# Altium schematic sheet Sintetizador_BA.SchDoc
size A4
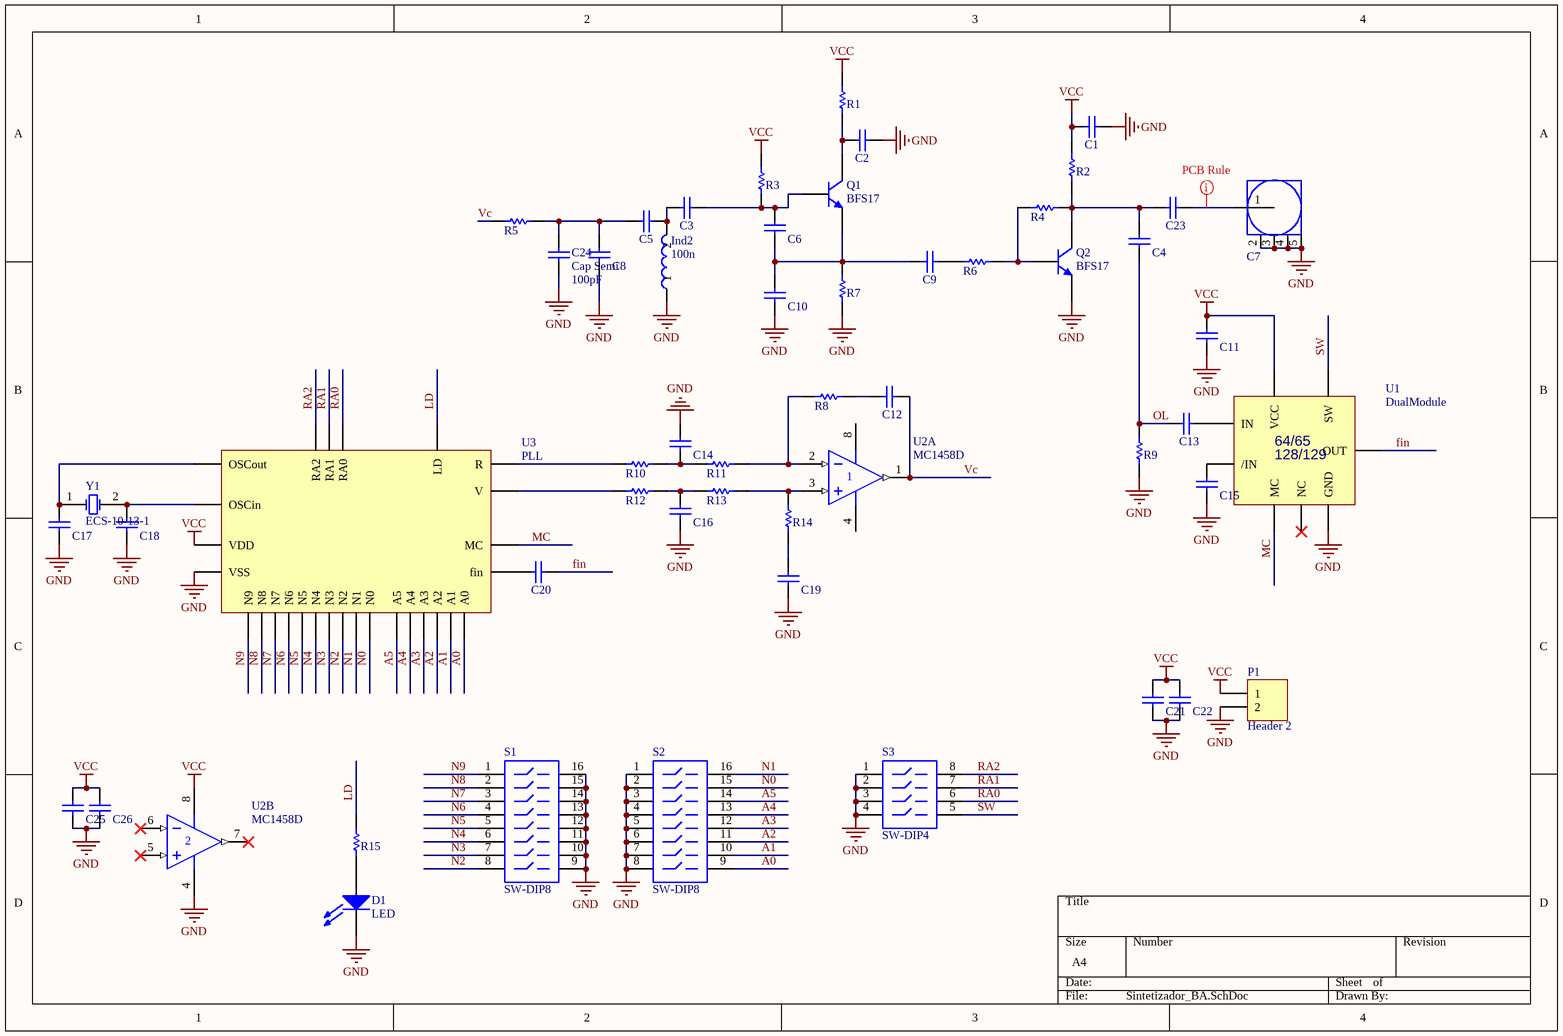
[diagram p0: Sintetizador_BA.SchDoc]

## Parts
C1  Capacitor  [0805_CAP]  (value not drawn)
C2  Capacitor  [0805_CAP]  (value not drawn)
C3  Capacitor  [0805_CAP]  (value not drawn)
C4  Capacitor  [0805_CAP]  (value not drawn)
C5  Capacitor  [0805_CAP]  (value not drawn)
C6  Capacitor  [0805_CAP]  (value not drawn)
C7  SMA  [SMAL2]  (value not drawn)
C8  Capacitor  [0805_CAP]  (value not drawn)
C9  Capacitor  [0805_CAP]  (value not drawn)
C10  Capacitor  [0805_CAP]  (value not drawn)
C11  Capacitor  [0805_CAP]  (value not drawn)
C12  Capacitor  [0805_CAP]  (value not drawn)
C13  Capacitor  [0805_CAP]  (value not drawn)
C14  Capacitor  [0805_CAP]  (value not drawn)
C15  Capacitor  [0805_CAP]  (value not drawn)
C16  Capacitor  [0805_CAP]  (value not drawn)
C17  Capacitor  [0805_CAP]  (value not drawn)
C18  Capacitor  [0805_CAP]  (value not drawn)
C19  Capacitor  [0805_CAP]  (value not drawn)
C20  Capacitor  [0805_CAP]  (value not drawn)
C21  Capacitor  [0805_CAP]  (value not drawn)
C22  Capacitor  [0805_CAP]  (value not drawn)
C23  Capacitor  [0805_CAP]  (value not drawn)
C24  Cap Semi  value 100pF  [C1206]
C25  Capacitor  [0805_CAP]  (value not drawn)
C26  Capacitor  [0805_CAP]  (value not drawn)
D1  LED  [PLCC-2Rojo]
Ind2  Valor: 100n  [Ind_4mm]  (hidden comment: Ind2)
P1  Header 2  [HDR1X2]
Q1  BFS17  [SOT-23]
Q2  BFS17  [SOT23_N]
R1  Resistor  [0805_RES]  (value not drawn)
R2  Resistor  [0805_RES]  (value not drawn)
R3  Resistor  [0805_RES]  (value not drawn)
R4  Resistor  [0805_RES]  (value not drawn)
R5  Resistor  [0805_RES]  (value not drawn)
R6  Resistor  [0805_RES]  (value not drawn)
R7  Resistor  [0805_RES]  (value not drawn)
R8  Resistor  [0805_RES]  (value not drawn)
R9  Resistor  [0805_RES]  (value not drawn)
R10  Resistor  [0805_RES]  (value not drawn)
R11  Resistor  [0805_RES]  (value not drawn)
R12  Resistor  [0805_RES]  (value not drawn)
R13  Resistor  [0805_RES]  (value not drawn)
R14  Resistor  [0805_RES]  (value not drawn)
R15  Resistor  [0805_RES]  (value not drawn)
S1  SW-DIP8  [DIP-16-KEY]
S2  SW-DIP8  [DIP-16-KEY]
S3  SW-DIP4  [DIP-8]
U1  DualModule  [SO-8_2]
U2  MC1458D  [751-05_N]  (parts A,B of 2)
U3  PLL  [SOG28]
Y1  ECS-10-13-1  [HC-49U]

## Nets
GND: C1.1 C2.1 C7.2(GND) C7.3(GND) C7.4(GND) C7.5(GND) C8.1 C10.2 C11.2 C14.2 C15.2 C16.1 C17.1 C18.1 C19.1 C21.1 C22.1 C24.2 C25.1 C26.1 D1.2(K) Ind2.1 P1.2 Q2.2(E) R7.1 R9.2 S1.9 S1.10 S1.11 S1.12 S1.13 S1.14 S1.15 S1.16 S2.1 S2.2 S2.3 S2.4 S2.5 S2.6 S2.7 S2.8 S3.1 S3.2 S3.3 S3.4 U1.5(GND) U2.4(V-) U3.2(VSS)
VCC: C1.2 C11.1 C21.2 C22.2 C25.2 C26.2 P1.1 R1.1 R2.1 R3.1 U1.2(VCC) U2.8(V+) U3.3(VDD)
A0: S2.9 U3.23(A0)
A1: S2.10 U3.21(A1)
A2: S2.11 U3.22(A2)
A3: S2.12 U3.24(A3)
A4: S2.13 U3.25(A4)
A5: S2.14 U3.10(A5)
fin: C20.1 U1.4(OUT)
LD: R15.1 U3.28(LD)
MC: U1.6(MC) U3.9(MC)
N0: S2.15 U3.11(N0)
N1: S2.16 U3.12(N1)
N2: S1.8 U3.13(N2)
N3: S1.7 U3.14(N3)
N4: S1.6 U3.15(N4)
N5: S1.5 U3.16(N5)
N6: S1.4 U3.17(N6)
N7: S1.3 U3.18(N7)
N8: S1.2 U3.19(N8)
N9: S1.1 U3.20(N9)
OL: C4.2 C13.2 R9.1
RA0: S3.6 U3.4(RA0)
RA1: S3.7 U3.5(RA1)
RA2: S3.8 U3.6(RA2)
SW: S3.5 U1.3(SW)
Vc: C12.1 R5.1 U2.1(OUT)
NetC2_2: C2.2 Q1.3(C) R1.2
NetC3_1: C3.1 C6.1 Q1.1(B) R3.2
NetC3_2: C3.2 C5.1 Ind2.2
NetC4_1: C4.1 C23.2 Q2.3(C) R2.2 R4.1
NetC5_2: C5.2 C8.2 C24.1 R5.2
NetC6_2: C6.2 C9.1 C10.1 Q1.2(E) R7.2
NetC7_1: C7.1(RF) C23.1
NetC9_2: C9.2 R6.2
NetC12_2: C12.2 R8.1
NetC13_1: C13.1 U1.1(IN)
NetC14_1: C14.1 R10.2 R11.1
NetC15_1: C15.1 U1.8(/IN)
NetC16_2: C16.2 R12.2 R13.1
NetC17_2: C17.2 U3.26(OSCout) Y1.1(OSC1)
NetC18_2: C18.2 U3.27(OSCin) Y1.2(OSC2)
NetC19_2: C19.2 R14.1
NetC20_2: C20.2 U3.1(fin)
NetD1_1: D1.1(A) R15.2
NetQ2_1: Q2.1(B) R4.2 R6.1
NetR8_2: R8.2 R11.2 U2.2(IN-)
NetR10_1: R10.1 U3.7(R)
NetR12_1: R12.1 U3.8(V)
NetR13_2: R13.2 R14.2 U2.3(IN+)

Not connected (* = marked no-connect by the designer): U1 7(NC)*; U2 5(IN+)* 6(IN-)* 7(OUT)*

## Layout directives
rule Width Constraint [Pref Width = 1mm    Min Width = 0.254mm    Max Width = 3mm]: NetC7_1

## Notes on the sheet
- (in symbol MC12054ASD) 64/65; 128/129

## Library data of the parts
C1-C6 C8-C23 C25 C26 = Cap
C24 = Cap Semi: Capacitor (Semiconductor SIM Model); Published: 8-Jun-2000; LatestRevisionDate: 17-Jul-2002; LatestRevisionNote: Re-released for DXP Platform.; PackageReference: C1206; Publisher: Altium Limited
D1 = LED1
P1 = Header 2: Header, 2-Pin; LatestRevisionDate: 17-Jul-2002; LatestRevisionNote: Re-released for DXP Platform.; Publisher: Altium Limited
Q1 Q2 = BFS17: NPN 1 GHz Wideband Transistor; Published: 17-Sep-2003; LatestRevisionDate: 12-Dec-2006; LatestRevisionNote: IPC-7351 Footprint Added.; DatasheetVersion: Sep-1995; PackageVersion: May-1999; PackageReference: SOT23; Publisher: Altium Limited; PackageDescription: 3-Pin SOT-23 Package 0.95 mm Pitch, 2.3 mm Lead Span; ComponentLink1Description: Manufacturer Link; ComponentLink1URL: http://www.semiconductors.philips.com/; ComponentLink2Description: Datasheet; ComponentLink2URL: http://www.semiconductors.philips.com/acrobat/datasheets/BFS17_2.pdf
R1-R15 = Res
S1 S2 = SW-DIP8: 4009 Series DIP Switch, Raised actuator; Published: 24-Mar-1999; LatestRevisionDate: 17-Dec-2003; LatestRevisionNote: PCB Footprint replaced.; PackageReference: DIP-16-KEY; Publisher: Altium Limited; ComponentLink1Description: Manufacturer Link; ComponentLink1URL: http://www.oupiin.com/prodindx.html#Headers
S3 = SW-DIP4: DIP Switch; Published: 24-Mar-1999; LatestRevisionDate: 17-Jul-2002; LatestRevisionNote: Re-released for DXP Platform.; PackageReference: DIP-8; Publisher: Altium Limited
U1 = MC12054ASD
U2 = MC1458D: Dual Operational Amplifier, Internally Compensated; Published: 17-Jul-2002; LatestRevisionDate: 13-Apr-2006; LatestRevisionNote: IPC-7351 Footprint Added.; DatasheetVersion: 1996; PackageVersion: 1996; PackageReference: 751-05; Publisher: Altium Limited; PackageDescription: 8-Pin Small Outline Integrated Circuit 1.27 mm Pitch; Code_JEDEC: MS-012-AA; Code_IPC: SOIC127P600-8; ComponentLink1Description: Manufacturer Link; ComponentLink1URL: http://www.onsemi.com/site/products/parametrics/0,4446,251,00.html
U3 = MC145152P2: PLL paralelo doble modulo
Y1 = ECS-10-13-1: Crystal Oscillator; Published: 17-Jul-2002; DatasheetDocument: 18-Apr-2000; PackageReference: HC-49U; Publisher: Altium Limited; ComponentLink1Description: Manufacturer Link; ComponentLink1URL: http://www.ecsxtal.com/; ComponentLink2Description: Datasheet; ComponentLink2URL: http://www.ecsxtal.com/pdf2/HC49U.PDF